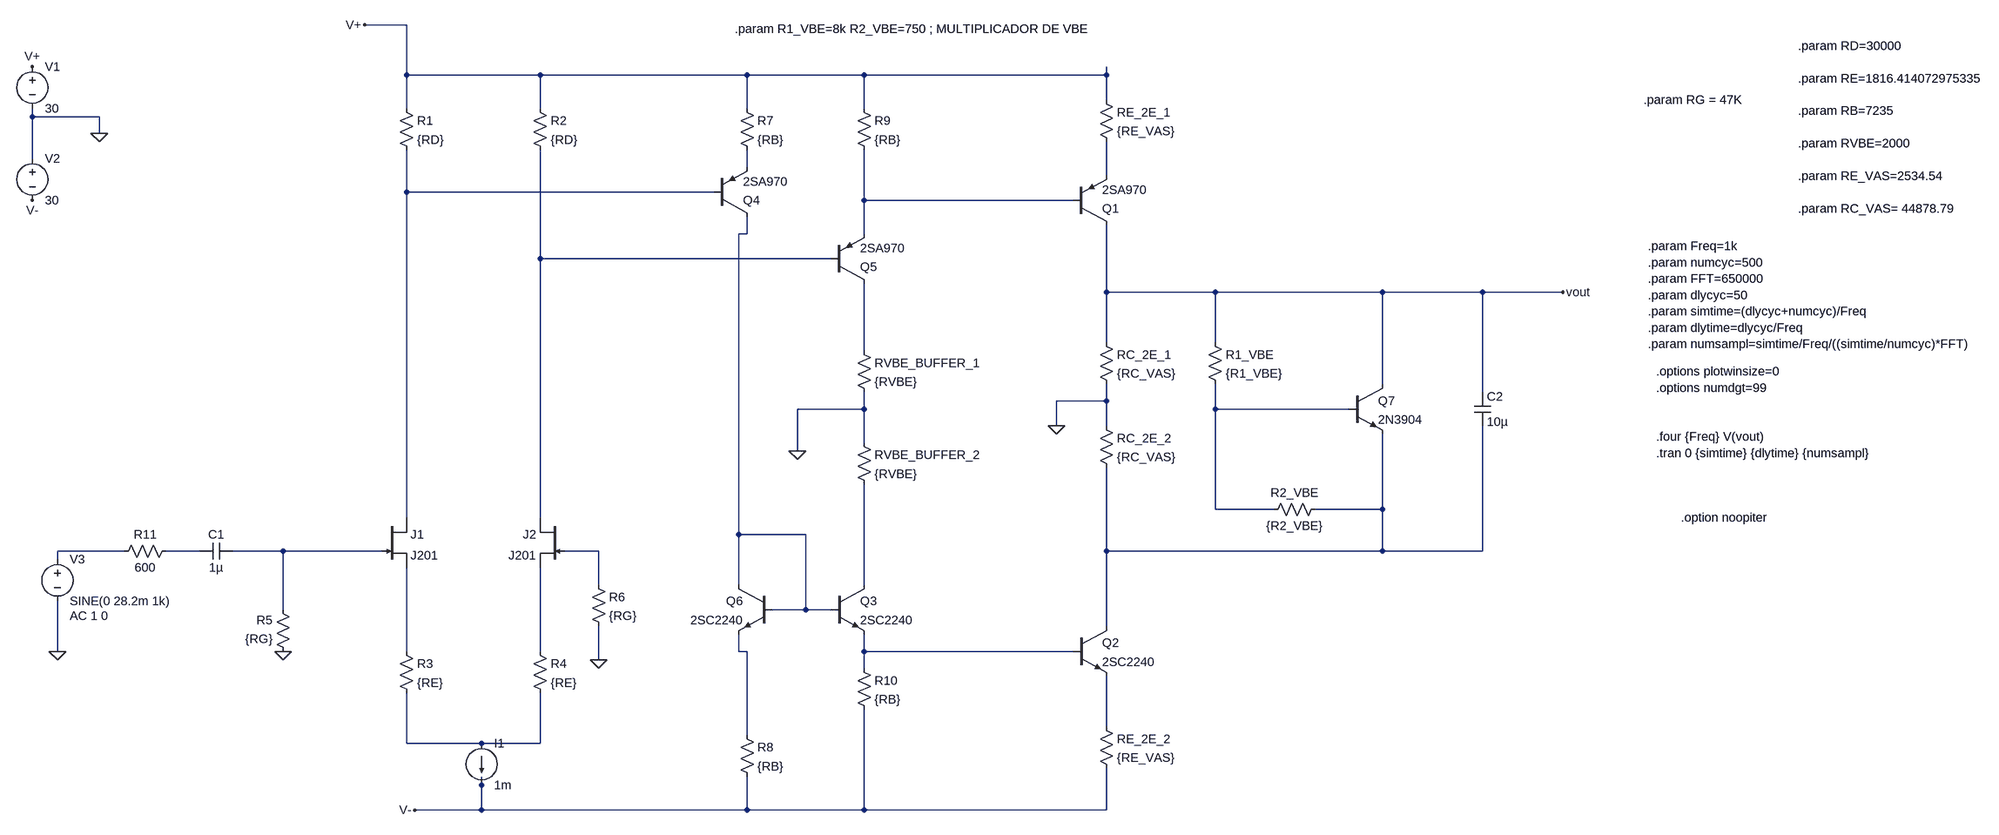
[diagram p0: schematic 2E_JFET_THD_COPIA_COM_VALORES.asc]
2E_JFET_THD_COPIA_COM_VALORES.asc, the LTspice schematic file:
Version 4
SHEET 1 6468 1752
WIRE 176 -496 96 -496
WIRE 176 -400 176 -496
WIRE 432 -400 176 -400
WIRE 1040 -400 432 -400
WIRE 1264 -400 1040 -400
WIRE 1728 -400 1728 -416
WIRE 1728 -400 1264 -400
WIRE 1728 -352 1728 -400
WIRE 176 -336 176 -400
WIRE 432 -336 432 -400
WIRE 1040 -336 1040 -400
WIRE 1264 -336 1264 -400
WIRE -592 -320 -592 -336
WIRE -464 -320 -592 -320
WIRE -464 -288 -464 -320
WIRE -592 -240 -592 -320
WIRE 1040 -224 1040 -256
WIRE 1728 -208 1728 -272
WIRE 176 -176 176 -256
WIRE 976 -176 176 -176
WIRE 1264 -160 1264 -256
WIRE 1664 -160 1264 -160
WIRE 1040 -96 1040 -128
WIRE 1040 -96 1024 -96
WIRE 1264 -96 1264 -160
WIRE 432 -48 432 -256
WIRE 1200 -48 432 -48
WIRE 1728 16 1728 -112
WIRE 1936 16 1728 16
WIRE 2256 16 1936 16
WIRE 2448 16 2256 16
WIRE 2640 16 2448 16
WIRE 1728 112 1728 16
WIRE 1936 112 1936 16
WIRE 1264 128 1264 0
WIRE 2256 192 2256 16
WIRE 2448 208 2448 16
WIRE 1728 224 1728 192
WIRE 1728 224 1632 224
WIRE 1264 240 1264 208
WIRE 1264 240 1136 240
WIRE 1936 240 1936 192
WIRE 2192 240 1936 240
WIRE 1632 272 1632 224
WIRE 1728 272 1728 224
WIRE 1264 304 1264 240
WIRE 1136 320 1136 240
WIRE 1936 432 1936 240
WIRE 2048 432 1936 432
WIRE 2256 432 2256 288
WIRE 2256 432 2128 432
WIRE 176 448 176 -176
WIRE 432 448 432 -48
WIRE 1024 480 1024 -96
WIRE 1152 480 1024 480
WIRE -416 512 -544 512
WIRE -272 512 -336 512
WIRE -112 512 -208 512
WIRE 128 512 -112 512
WIRE 544 512 480 512
WIRE 1728 512 1728 352
WIRE 2256 512 2256 432
WIRE 2256 512 1728 512
WIRE 2448 512 2448 272
WIRE 2448 512 2256 512
WIRE -544 528 -544 512
WIRE 544 576 544 512
WIRE 1024 576 1024 480
WIRE 1264 576 1264 384
WIRE -112 624 -112 512
WIRE 1152 624 1152 480
WIRE 1152 624 1088 624
WIRE 1200 624 1152 624
WIRE 1728 656 1728 512
WIRE -544 704 -544 608
WIRE 176 704 176 544
WIRE 432 704 432 544
WIRE 1024 704 1024 672
WIRE 1040 704 1024 704
WIRE 1264 704 1264 672
WIRE 1664 704 1264 704
WIRE 544 720 544 656
WIRE 1264 736 1264 704
WIRE 1728 848 1728 752
WIRE 1040 864 1040 704
WIRE 176 880 176 784
WIRE 320 880 176 880
WIRE 432 880 432 784
WIRE 432 880 320 880
WIRE 320 960 320 944
WIRE 320 1008 320 960
WIRE 320 1008 192 1008
WIRE 1040 1008 1040 944
WIRE 1040 1008 320 1008
WIRE 1264 1008 1264 816
WIRE 1264 1008 1040 1008
WIRE 1728 1008 1728 928
WIRE 1728 1008 1264 1008
FLAG -464 -288 0
FLAG -592 -416 V+
FLAG -592 -160 V-
FLAG 544 720 0
FLAG 192 1008 V-
FLAG 96 -496 V+
FLAG -544 704 0
FLAG -112 704 0
FLAG 1136 320 0
FLAG 1632 272 0
FLAG 2640 16 vout
SYMBOL voltage -592 -432 R0
WINDOW 123 0 0 Left 0
WINDOW 39 0 0 Left 0
SYMATTR InstName V1
SYMATTR Value 30
SYMBOL voltage -592 -256 R0
WINDOW 123 0 0 Left 0
WINDOW 39 0 0 Left 0
SYMATTR InstName V2
SYMATTR Value 30
SYMBOL current 320 880 R0
WINDOW 123 0 0 Left 0
WINDOW 39 0 0 Left 0
SYMATTR InstName I1
SYMATTR Value 1m
SYMBOL res 160 -352 R0
SYMATTR InstName R1
SYMATTR Value {RD}
SYMBOL res 416 -352 R0
SYMATTR InstName R2
SYMATTR Value {RD}
SYMBOL res 1024 -352 R0
SYMATTR InstName R7
SYMATTR Value {RB}
SYMBOL res 1248 -352 R0
SYMATTR InstName R9
SYMATTR Value {RB}
SYMBOL res 1024 848 R0
SYMATTR InstName R8
SYMATTR Value {RB}
SYMBOL res 1248 720 R0
SYMATTR InstName R10
SYMATTR Value {RB}
SYMBOL npn 1200 576 R0
SYMATTR InstName Q3
SYMATTR Value 2SC2240
SYMBOL pnp 976 -128 M180
SYMATTR InstName Q4
SYMATTR Value 2SA970
SYMBOL res 160 688 R0
SYMATTR InstName R3
SYMATTR Value {RE}
SYMBOL res 416 688 R0
SYMATTR InstName R4
SYMATTR Value {RE}
SYMBOL res -96 720 R180
WINDOW 0 36 76 Left 2
WINDOW 3 36 40 Left 2
SYMATTR InstName R5
SYMATTR Value {RG}
SYMBOL res 528 560 R0
SYMATTR InstName R6
SYMATTR Value {RG}
SYMBOL pnp 1200 0 M180
SYMATTR InstName Q5
SYMATTR Value 2SA970
SYMBOL npn 1088 576 M0
SYMATTR InstName Q6
SYMATTR Value 2SC2240
SYMBOL voltage -544 512 R0
WINDOW 123 24 124 Left 2
WINDOW 39 0 0 Left 0
SYMATTR Value2 AC 1 0
SYMATTR InstName V3
SYMATTR Value SINE(0 28.2m 1k)
SYMBOL njf 128 448 R0
SYMATTR InstName J1
SYMATTR Value J201
SYMBOL njf 480 448 M0
SYMATTR InstName J2
SYMATTR Value J201
SYMBOL pnp 1664 -112 M180
SYMATTR InstName Q1
SYMATTR Value 2SA970
SYMBOL res 1712 -368 R0
SYMATTR InstName RE_2E_1
SYMATTR Value {RE_VAS}
SYMBOL res 1712 96 R0
SYMATTR InstName RC_2E_1
SYMATTR Value {RC_VAS}
SYMBOL res 1712 256 R0
SYMATTR InstName RC_2E_2
SYMATTR Value {RC_VAS}
SYMBOL npn 1664 656 R0
SYMATTR InstName Q2
SYMATTR Value 2SC2240
SYMBOL res 1712 832 R0
SYMATTR InstName RE_2E_2
SYMATTR Value {RE_VAS}
SYMBOL res 1920 96 R0
SYMATTR InstName R1_VBE
SYMATTR Value {R1_VBE}
SYMBOL res 2144 416 R90
WINDOW 0 0 56 VBottom 2
WINDOW 3 32 56 VTop 2
SYMATTR InstName R2_VBE
SYMATTR Value {R2_VBE}
SYMBOL cap 2432 208 R0
SYMATTR InstName C2
SYMATTR Value 10µ
SYMBOL npn 2192 192 R0
SYMATTR InstName Q7
SYMATTR Value 2N3904
SYMBOL res 1248 112 R0
SYMATTR InstName RVBE_BUFFER_1
SYMATTR Value {RVBE}
SYMBOL res 1248 288 R0
SYMATTR InstName RVBE_BUFFER_2
SYMATTR Value {RVBE}
SYMBOL cap -208 496 R90
WINDOW 0 0 32 VBottom 2
WINDOW 3 32 32 VTop 2
SYMATTR InstName C1
SYMATTR Value 1µ
SYMBOL res -320 496 R90
WINDOW 0 0 56 VBottom 2
WINDOW 3 32 56 VTop 2
SYMATTR InstName R11
SYMATTR Value 600
TEXT 1016 -488 Left 2 !.param R1_VBE=8k R2_VBE=750 ; MULTIPLICADOR DE VBE
TEXT 2808 -352 Left 2 !.param RG = 47K
TEXT 2816 -72 Left 2 !.param Freq=1k\n.param numcyc=500\n.param FFT=650000\n.param dlycyc=50\n.param simtime=(dlycyc+numcyc)/Freq\n.param dlytime=dlycyc/Freq\n.param numsampl=simtime/Freq/((simtime/numcyc)*FFT)
TEXT 2832 168 Left 2 !.options plotwinsize=0\n.options numdgt=99\n \n \n.four {Freq} V(vout)\n.tran 0 {simtime} {dlytime} {numsampl}
TEXT 3104 -456 Left 2 !.param RD=30000\n \n.param RE=1816.414072975335\n \n.param RB=7235\n \n.param RVBE=2000\n \n.param RE_VAS=2534.54\n \n.param RC_VAS= 44878.79
TEXT 2880 448 Left 2 !.option noopiter

The netlist it stands for:
* 2E_JFET_THD_COPIA_COM_VALORES.asc
V1 V+ 0 30
V2 0 V- 30
I1 N020 V- 1m
R1 V+ N003 {RD}
R2 V+ N006 {RD}
R7 V+ N001 {RB}
R9 V+ N004 {RB}
R8 N017 V- {RB}
R10 N018 V- {RB}
Q3 N014 N005 N018 0 2SC2240
Q4 N005 N003 N001 0 2SA970
R3 N015 N020 {RE}
R4 N016 N020 {RE}
R5 0 N012 {RG}
R6 N013 0 {RG}
Q5 N007 N006 N004 0 2SA970
Q6 N005 N005 N017 0 2SC2240
V3 N010 0 SINE(0 28.2m 1k) AC 1 0
J1 N003 N012 N015 J201
J2 N006 N013 N016 J201
Q1 vout N004 N002 0 2SA970
RE_2E_1 V+ N002 {RE_VAS}
RC_2E_1 vout 0 {RC_VAS}
RC_2E_2 0 N009 {RC_VAS}
Q2 N009 N018 N019 0 2SC2240
RE_2E_2 N019 V- {RE_VAS}
R1_VBE vout N008 {R1_VBE}
R2_VBE N009 N008 {R2_VBE}
C2 vout N009 10µ
Q7 vout N008 N009 0 2N3904
RVBE_BUFFER_1 N007 0 {RVBE}
RVBE_BUFFER_2 0 N014 {RVBE}
C1 N012 N011 1µ
R11 N011 N010 600
.model NPN NPN
.model PNP PNP
.lib standard.bjt
.model NJF NJF
.model PJF PJF
.lib standard.jft
.param R1_VBE=8k R2_VBE=750 ; MULTIPLICADOR DE VBE
.param RG = 47K
.param Freq=1k
.param numcyc=500
.param FFT=650000
.param dlycyc=50
.param simtime=(dlycyc+numcyc)/Freq
.param dlytime=dlycyc/Freq
.param numsampl=simtime/Freq/((simtime/numcyc)*FFT)
.options plotwinsize=0
.options numdgt=99
.four {Freq} V(vout)
.tran 0 {simtime} {dlytime} {numsampl}
.param RD=30000
.param RE=1816.414072975335
.param RB=7235
.param RVBE=2000
.param RE_VAS=2534.54
.param RC_VAS= 44878.79
.option noopiter
.backanno
.end